# EAGLE design sersors (EAGLE 6.5.0)
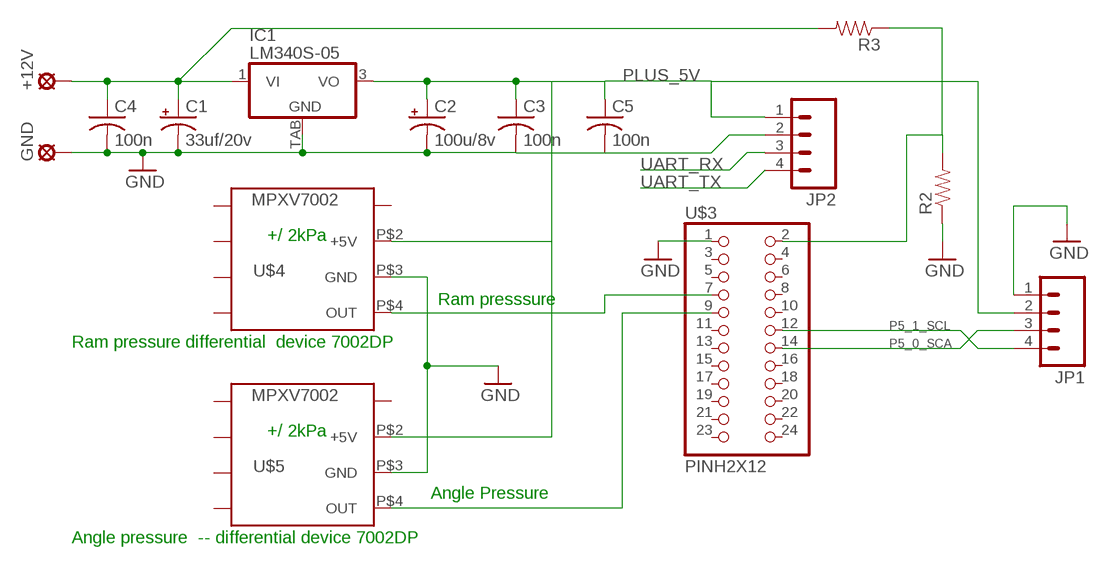
[diagram p0: schematic, sheet 1]

## Parts
+12V  LSP10  [LSP10]
C1  33uf/20v  CPOL-USSMCD  [SMC_D]
C2  100u/8v  CPOL-USSMCD  [SMC_D]
C3  100n  C-USC1206K  [C1206K]
C4  100n  C-USC1206K  [C1206K]
C5  100n  C-USC1206K  [C1206K]
GND  LSP10  [LSP10]
IC1  LM340S-05  [TO263-3]
JP1  M04PTH  [1X04]
JP2  M04PTH  [1X04]
R2  RESISTOR0603-RES  [0603-RES]
R3  RESISTOR0603-RES  [0603-RES]
U$3  PINH2X12  [2X12]
U$4  MPXV7002  [MPXV]
U$5  MPXV7002  [MPXV]

## Nets
GND: C1.- C2.- C3.2 C4.2 C5.2 GND.MP IC1.TAB(GND) JP1.1 JP2.2 R2.1 U$3.1 U$4.P$3(GND) U$5.P$3(GND)
N$1: +12V.MP C1.+ C4.1 IC1.1(VI) R3.2
N$2: U$3.7 U$4.P$4(OUT)
N$4: R2.2 R3.1 U$3.2
P3_1: U$3.9 U$5.P$4(OUT)
P5_0_SCA: JP1.3 U$3.14
P5_1_SCL: JP1.4 U$3.12
PLUS_5V: C2.+ C3.1 C5.1 IC1.3(VO) JP1.2 JP2.1 U$4.P$2(+5V) U$5.P$2(+5V)
UART_RX: JP2.3
UART_TX: JP2.4
Unconnected: U$3.3 U$3.4 U$3.5 U$3.6 U$3.8 U$3.10 U$3.11 U$3.13 U$3.15 U$3.16 U$3.17 U$3.18 U$3.19 U$3.20 U$3.21 U$3.22 U$3.23 U$3.24 U$4.P$1 U$4.P$5 U$4.P$6 U$4.P$7 U$4.P$8 U$5.P$1 U$5.P$5 U$5.P$6 U$5.P$7 U$5.P$8

## Notes on the sheet
- +/ 2kPa
- Ram presssure
- Ram pressure differential  device 7002DP
- +/ 2kPa
- Angle Pressure
- Angle pressure  -- differential device 7002DP

## Library data of the parts
+12V GND = solpad:LSP10: SOLDER PAD drill 1.0 mm, distributor Buerklin, 12H555
C1 C2 = rcl:CPOL-US: POLARIZED CAPACITOR, American symbol
C3-C5 = rcl:C-US: CAPACITOR, American symbol
IC1 = Stofer:LM340?-*: Positive VOLTAGE REGULATOR Source: http://cache.national.com/ds/LM/LM340.pdf
JP1 JP2 = SparkFun-Connectors:M04: Header 4 Standard 4-pin 0.1" header. Use with straight break away headers (SKU : PRT-00116), right angle break away headers (PRT-00553), swiss pins (PRT-00743), machine pins (PRT-00117), and female headers (PRT-00115). Molex polarized connector foot print use with SKU : PRT-08231 with associated crimp pins and housings. 1MM SMD Version SKU: PRT-10208
R2 R3 = SparkFun-Passives:RESISTOR: Resistor Basic schematic elements and footprints for 0603, 1206, and PTH resistors.
U$3 = SparkFun-Connectors:PINH2X12
U$4 U$5 = Stofer:MPXV7002: 2Kpa dual port pressure sensor

## Board
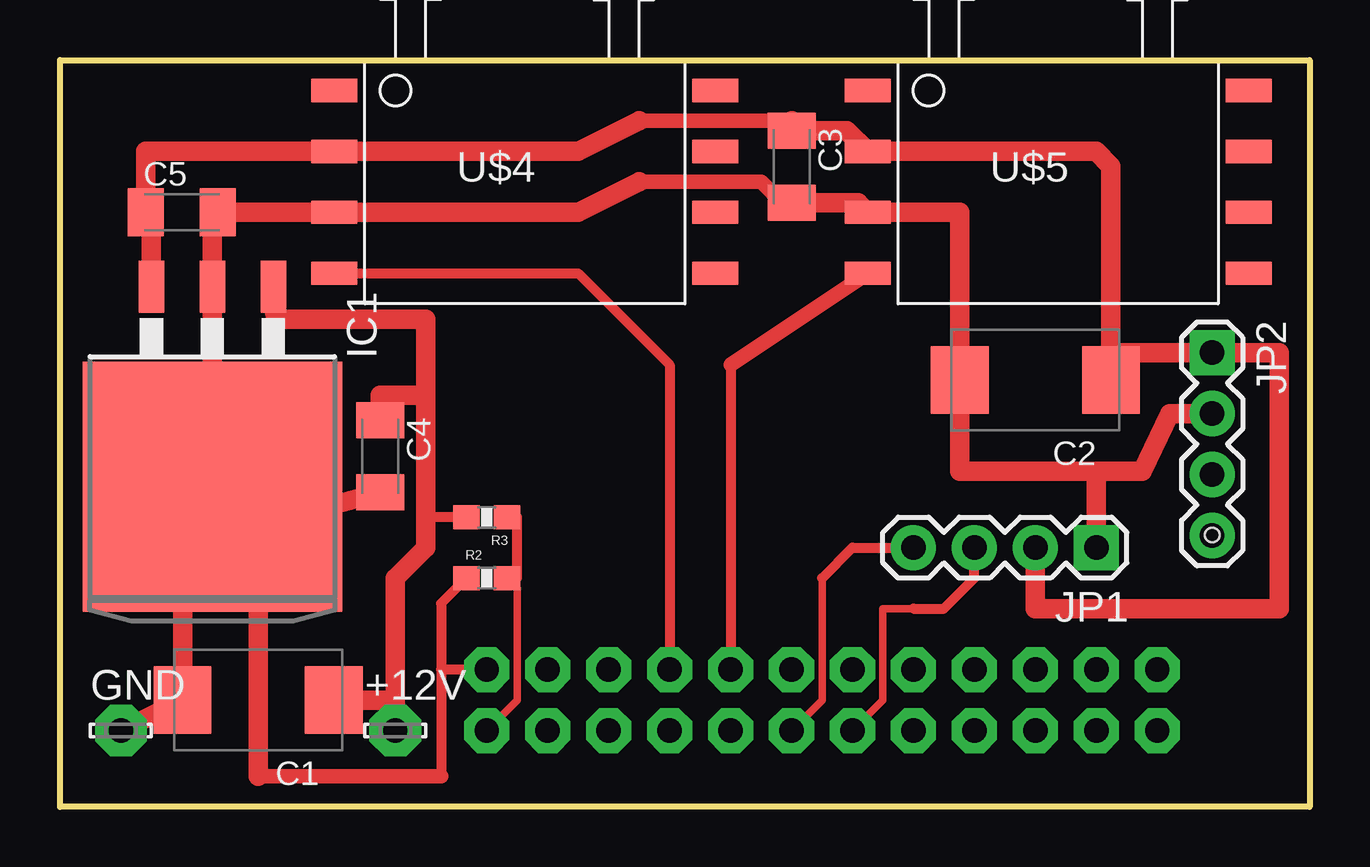
[diagram p1: board, top side]
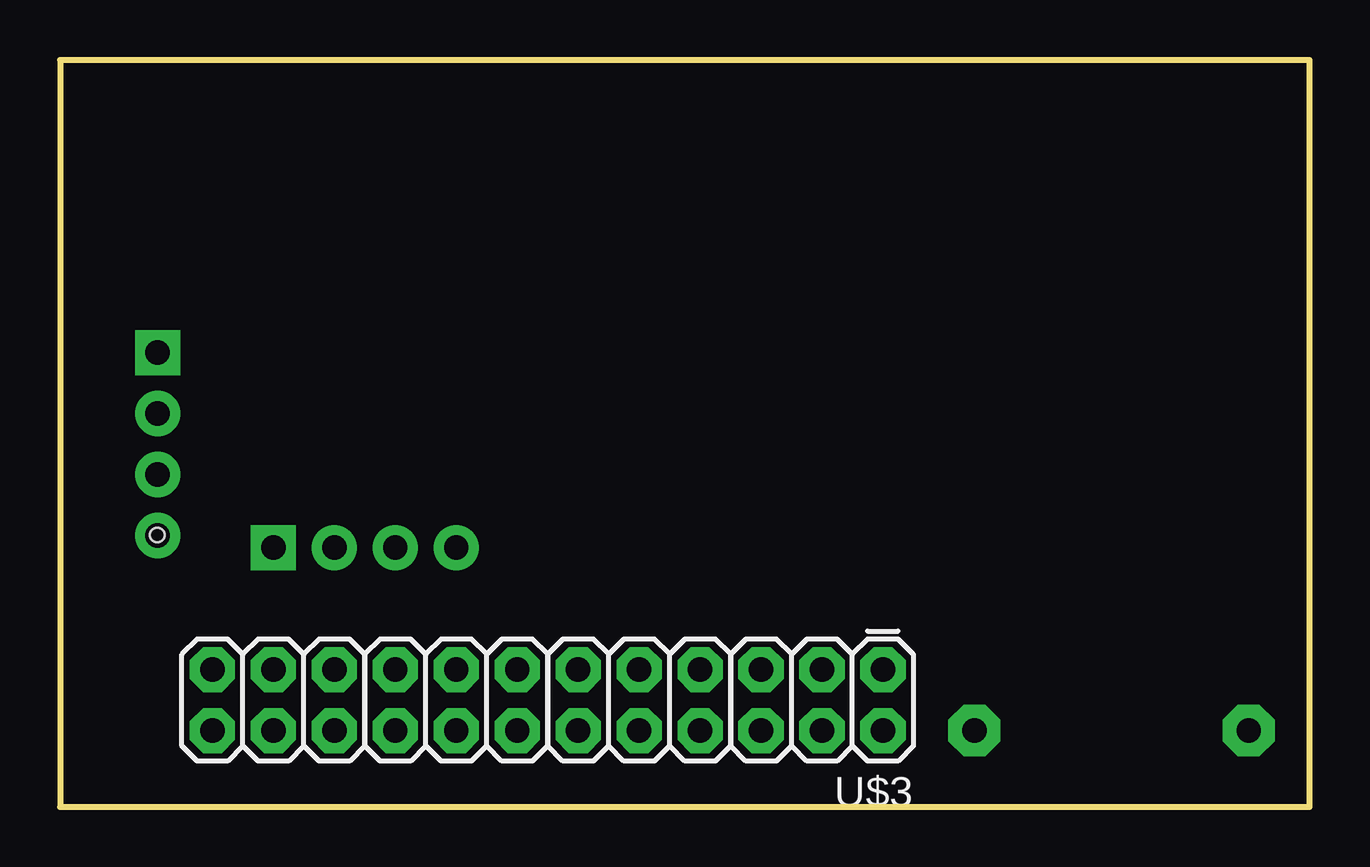
[diagram p2: board, bottom side, seen from below]

Size 52.07 x 31.12 mm. Coordinates in mm from the lower left corner, seen from the top.
Outline: 0,31.12 52.07,31.12 52.07,0 0,0 0,31.12
Copper layers (1*16): Top 0.0356mm / dielectric 1.5011mm / Bottom 0.0356mm
Design rules "OSH *": minimum track width 6mil, minimum drill 13mil, track to track 6mil, track to pad 6mil, pad to pad 6mil, via to via 6mil, smd to smd 6mil, copper to edge 15mil, drill to drill 6mil, minimum pad ring 10mil, minimum via ring 9mil, stop-mask expansion 3mil, vias tented up to drill 0mil, thermal gap 10mil
Holes 0.6 mm at 48.02,11.32

### Footprints (pad centres in the part's own frame; a part is rotated, then mirrored left to right if it is on the bottom)
LSP10 = drill 1.016 pad 2.159 octagon: MP 0,0
SMC_D = smd 2.4 x 2.8: + -3.15,0; - 3.15,0
C1206K = smd 1.5 x 2: 1 -1.5,0; 2 1.5,0
TO263-3 = smd 1.067 x 2.159: 1 -2.54,-5.791; 2 0,-5.791; 3 2.54,-5.791 | smd 10.8 x 10.41: TAB 0,2.54
1X04 = drill 1.016 pad 1.88 square: 1 0,0 | drill 1.016 pad 1.88: 2 2.54,0; 3 5.08,0; 4 7.62,0
0603-RES = smd 1.1 x 1: 1 -0.85,0; 2 0.85,0
2X12 = drill 1.016 pad 1.88 octagon: 1 -13.97,-1.27; 2 -13.97,1.27; 3 -11.43,-1.27; 4 -11.43,1.27; 5 -8.89,-1.27; 6 -8.89,1.27; 7 -6.35,-1.27; 8 -6.35,1.27; 9 -3.81,-1.27; 10 -3.81,1.27; 11 -1.27,-1.27; 12 -1.27,1.27; 13 1.27,-1.27; 14 1.27,1.27; 15 3.81,-1.27; 16 3.81,1.27; 17 6.35,-1.27; 18 6.35,1.27; 19 8.89,-1.27; 20 8.89,1.27; 21 11.43,-1.27; 22 11.43,1.27; 23 13.97,-1.27; 24 13.97,1.27
MPXV = smd 1.93 x 0.965: P$1 0,0; P$2 0,-2.54; P$3 0,-5.08; P$4 0,-7.62; P$5 15.875,-7.62; P$6 15.875,-5.08; P$7 15.875,-2.54; P$8 15.875,0

### Placement (x,y rotation side)
+12V  13.97,3.18 0 top
C1  8.25,4.45 180 top
C2  40.64,17.78 180 top
C3  30.48,26.67 270 top
C4  13.34,14.61 270 top
C5  5.08,24.77 0 top
GND  2.54,3.18 0 top
IC1  6.35,15.88 180 top
JP1  43.18,10.8 180 top
JP2  48,18.92 270 top
R2  17.78,9.52 0 top
R3  17.78,12.06 180 top
U$3  31.75,4.45 180 bottom
U$4  11.43,29.84 0 top
U$5  33.66,29.84 0 top

### Tracks (layer width: path | path; a pad name or v marks a point on that pad's centre or on a via)
GND
  Top 0.406: R2.1 15.88,8.47 15.88,5.72 | 15.88,5.72 15.88,1.27 | U$3.1 15.88,5.72
  Top 0.61: 5.11,13.36 arc-90 IC1.TAB 7.62,14.61 8.25,12.06 | 8.25,1.27 15.88,1.27 | C5.2 6.35,24.77 | 24.13,26.04 29.21,26.04 30.08,25.17
  Top 0.813: 5.11,13.36 C1.- GND.MP | IC1.TAB 6.35,24.77 U$4.P$3 21.59,24.77 24.13,26.04 | 8.25,8.89 8.25,12.06 7.85,11.84 | 8.25,8.89 8.25,1.27 | JP2.2 46.23,16.38 45.09,13.97 43.18,13.97 | 43.18,13.97 JP1.1 | 43.18,13.97 37.49,13.97 C2.- 37.49,24.77 U$5.P$3 33.25,25.17 C3.2 30.08,25.17 | C4.2 9.52,12.06 8.89,11.43 8.25,8.89
N$1
  Top 0.406: R3.2 15.24,12.06
  Top 0.813: C1.+ 13.97,4.45 | IC1.1 8.97,20.32 15.24,20.32 15.24,17.15 | 13.97,4.45 13.97,9.52 15.24,10.8 15.24,12.06 15.24,17.15 | C4.1 13.34,17.15 15.24,17.15 | +12V.MP 13.97,4.45
N$2
  Top 0.406: U$4.P$4 21.59,22.23 25.4,18.41 U$3.7
N$4
  Top 0.254: 19.05,9.52 R2.2 19.05,9.11
  Top 0.305: U$3.2 19.05,4.45 19.05,9.11
  Top 0.406: 19.05,9.52 19.05,12.06 R3.1
P3_1
  Top 0.406: 27.94,18.41 U$3.9
  Top 0.61: U$5.P$4 27.94,18.41
P5_0_SCA
  Top 0.305: U$3.14 34.29,4.45 34.29,8.26 35.56,8.26
  Top 0.406: 35.56,8.26 36.83,8.26 38.1,9.52 JP1.3
P5_1_SCL
  Top 0.305: U$3.12 31.75,4.45 31.75,9.52
  Top 0.406: 31.75,9.52 33.02,10.8 JP1.4
PLUS_5V
  Top 0.61: C5.1 3.81,24.77 | 24.13,28.58 30.48,28.58
  Top 0.813: IC1.3 3.81,24.77 | C5.1 3.58,27.3 U$4.P$2 21.59,27.3 24.13,28.58 | JP1.2 40.64,8.26 50.8,8.26 50.8,18.92 JP2.1 43.92,18.92 C2.+ 43.79,26.7 43.18,27.3 U$5.P$2 32.79,28.17 C3.1 30.48,28.58